# EasyEDA Pro project ProProject_AD9833.epro, board SMT
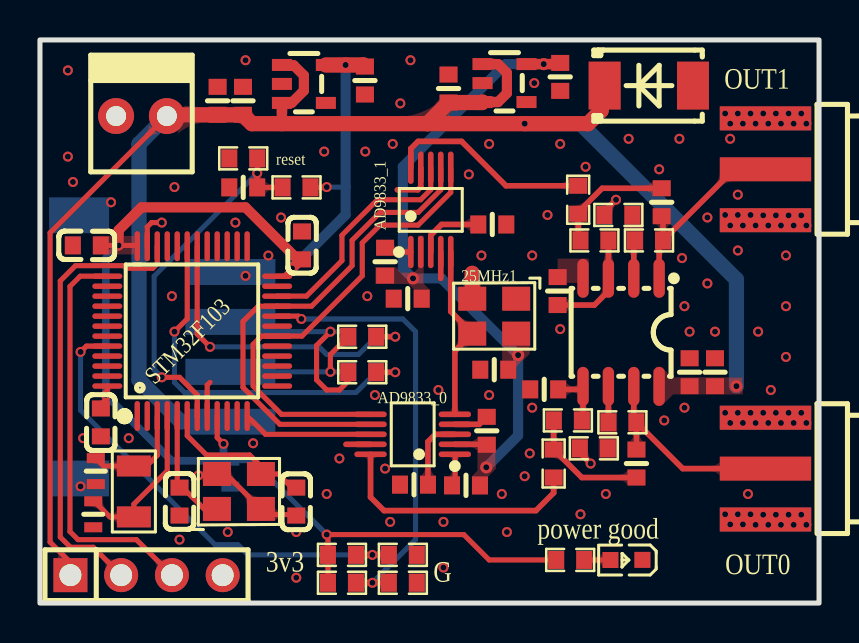
[diagram p10: board, top side]
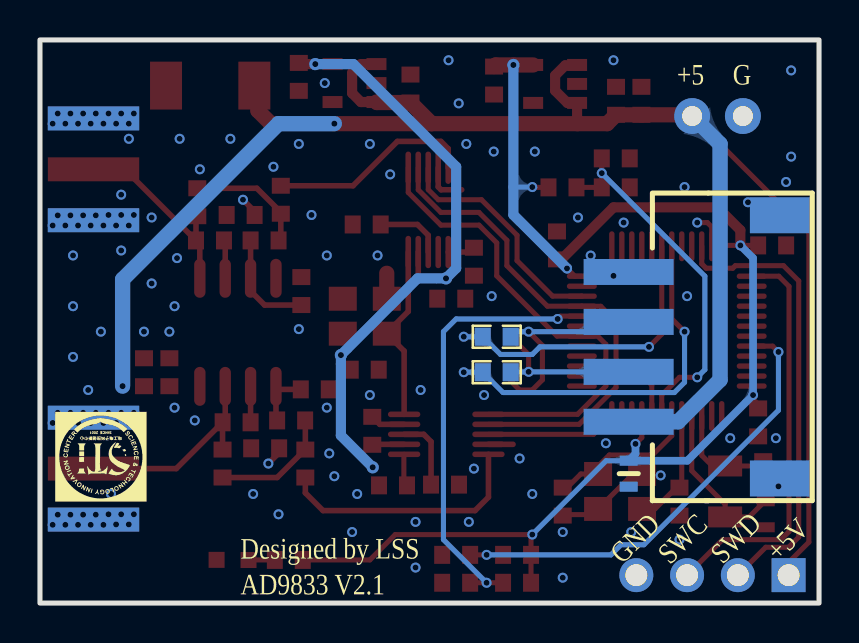
[diagram p11: board, bottom side, seen from below]

Outline 38.99 x 28.19 mm; copper layers: Top Layer, Bottom Layer. Coordinates in mm from the lower left corner of the outline.
Outline path: rectangle 0,28.19 38.99,0
Stack: Top Layer 0.035mm / Dielectric1 1.51mm FR4 er 4.5 / Bottom Layer 0.035mm

## Design rules (mm)
template: 自定义配置
spacing copperThickness1oz (default): track to track 0.102, other pairs 0.152 to 0.3
spacing copperThickness2oz: track to track 0.203, other pairs 0.152 to 0.3
track width copperThickness1oz (default): min 0.127, default 0.254, max 2.54
track width copperThickness2oz: min 0.203, default 0.254, max 2.54
differential pair differentialPair (default): width min 0.127, default 0.254, max 2.54; gap min 0.152, default 0.152
via viaSize (default): diameter min 0.5, default 0.61, max 10; hole min 0.3, default 0.305, max 6.299

## Placement (name value [footprint] x y rotation side)
25MHz1  25MHz  [OSC-SMD_4P-L3.2-W2.5-BL]  22.73 14.36 180 top
AD9833_0  AD9833WBRMZ-REEL  [MSOP-10_L3.0-W3.0-P0.50-LS5.0-BL]  18.65 8.45 90 top
AD9833_1  AD9833WBRMZ-REEL  [MSOP-10_L3.0-W3.0-P0.50-LS5.0-BL]  19.56 19.69 0 top
C1  10nF  [C0603]  21.32 5.89 180 top
C2  10nF  [C0603]  17.27 17.09 90 top
C3  10uF  [C0603]  8.89 25.15 270 top
C4  100nF  [C0603]  22.36 8.62 270 top
C5  100nF  [C0603]  18.41 15.24 0 top
C7  100nF  [C0603]  33.78 11.56 270 top
C8  100nF  [C0603]  22.74 11.68 0 top
C9  100nF  [C0603]  18.72 5.93 0 top
C10  100nF  [C0603]  22.64 18.95 180 top
C11  1uF  [C0603]  20.45 25.76 90 top
C12  1uF  [C0603]  26.03 26.34 90 top
C13  100nF  [C0603]  32.51 11.56 270 top
C14  1.5pF  [C0603]  25.91 15.62 270 top
C15  1.1pF  [C0603]  31.12 20.07 270 top
C16  1.5pF  [C0603]  25.24 10.7 0 top
C17  1.1pF  [C0603]  29.85 6.98 90 top
C18  20pF  [C0603]  6.99 5.08 270 top
C19  20pF  [C0603]  12.83 5.08 90 top
C20  20pF  [C0603 V1.2]  2.79 6.6 270 top
C21  20pF  [C0603 V1.2]  2.67 4.44 270 top
C29  0.1uF  [c0603]  10.17 20.81 0 top
C30  1uF  [C0603]  10.16 25.15 270 top
C31  1uF  [C0603]  16.26 26.16 90 top
C32  100nF  [C0603]  3.05 9.04 90 top
C33  100nF  [C0603]  2.35 17.91 0 top
C34  100nF  [C0603]  13.12 17.91 270 top
C35  100nF  [C0603 V1.2]  9.53 6.48 90 bottom
CN1  X8821WRS-04-9TSN  [conn-smd_x8821wrs-04-9tsn]  5.97 12.83 90 bottom
D4  SMBJ5.0A  [smb_l4.4-w3.6-ls5.3-rd]  30.48 25.91 0 top
H1  PZ254V-11-04P  [HDR-TH_4P-P2.54-V-M]  5.33 1.4 0 top
LED1  NCD0603R1  [LED0603-RD_RED]  29.35 2.16 180 top
Power1  -  [KF2510_2P]  5.08 24.38 0 top
R9  10k  [R0603]  28.95 19.43 0 top
R10  10k  [R0603]  30.48 18.16 0 top
R11  10k  [R0603]  27.75 18.16 180 top
R13  10k  [R0603]  26.94 20.19 90 top
R14  10k  [R0603]  27.72 7.75 0 top
R15  10k  [R0603]  29.15 9.05 0 top
R16  10k  [R0603]  26.42 9.14 180 top
R18  10k  [R0603]  25.71 6.98 270 top
R19  10k  [R0603]  12.84 20.81 0 top
R20  10k  [R0603]  16.13 13.33 180 top
R21  10k  [R0603]  16.13 11.56 180 top
R22  10k  [R0603]  16.13 11.56 0 bottom
R23  10k  [R0603]  16.13 13.33 180 bottom
R24  0  [R0603]  15.11 2.41 180 top
R25  0  [R0603]  18.16 2.41 180 top
R26  0  [R0603]  15.11 1.02 180 top
R27  0  [R0603]  18.16 1.02 180 top
R28  3k  [R0603]  26.54 2.16 180 top
reset  10k  [R0603]  10.17 22.26 0 top
RF1  BWSMA-KE-P001  [SMA-SMD_BWSMA-KE-P001]  36.19 6.73 0 top
RF2  BWSMA-KE-P001  [SMA-SMD_BWSMA-KE-P001]  36.19 21.72 0 top
U6  TPLP5907MFX-3.3  [SOT-23-5_L2.9-W1.6-P0.95-LS2.8-BR]  23.25 26.03 180 top
U7  OPA2350UA/2K5G4  [SOIC-8_L5.0-W4.0-P1.27-LS6.1-BL]  29.08 13.55 180 top
U8  STM32F103C8T6  [LQFP-48_L7.0-W7.0-P0.50-LS9.0-BL]  7.62 13.61 0 top
U9  TPS7A2033PDBVR  [SOT-23-5_L2.9-W1.6-P0.95-LS2.8-BR]  13.21 25.99 180 top
X1  8MHz  [OSC-SMD_4P-L3.2-W2.5-BL]  9.96 5.59 0 top
X2  32.768kHz  [OSC-SMD_L3.2-W1.5]  4.7 5.59 270 top

## Footprints (pads in the part's own frame, mm; a bottom-side part is the same pattern mirrored in y, then rotated)
c0603
  rect 0.8x0.9 smd: 1(-0.7,0) 2(0.7,0)
C0603
  rect 0.8x0.9 smd: 1(-0.7,0) 2(0.7,0)
C0603 V1.2
  rect 0.5x0.9 smd: 1(-0.65,0) 2(0.65,0)
conn-smd_x8821wrs-04-9tsn
  rect 1.3x4.5 smd: 1(-3.75,3.56) 2(-1.25,3.56) 3(1.25,3.56) 4(3.75,3.56)
  rect 1.8x3 smd: 5(6.59,-4.01) 6(-6.59,-4.01)
HDR-TH_4P-P2.54-V-M
  rect 1.7x1.7 hole 1.1: 1(-3.81,0)
  round 1.7 hole 1.1: 2(-1.27,0) 3(1.27,0) 4(3.81,0)
KF2510_2P
  rrect 1.8x1.8 hole 1: 1(-1.27,0) 2(1.27,0)
LED0603-RD_RED
  rect 0.8x0.8 smd: 1(-0.799,-0.004) 2(0.799,0.004)
LQFP-48_L7.0-W7.0-P0.50-LS9.0-BL
  oval 0.27x1.5 smd: 1(-2.75,-4.25) 2(-2.25,-4.25) 3(-1.75,-4.25) 4(-1.25,-4.25) 5(-0.75,-4.25) 6(-0.25,-4.25) 7(0.25,-4.25) 8(0.75,-4.25) 9(1.25,-4.25) 10(1.75,-4.25) 11(2.25,-4.25) 12(2.75,-4.25) 25(2.75,4.25) 26(2.25,4.25) 27(1.75,4.25) 28(1.25,4.25) 29(0.75,4.25) 30(0.25,4.25) 31(-0.25,4.25) 32(-0.75,4.25) 33(-1.25,4.25) 34(-1.75,4.25) 35(-2.25,4.25) 36(-2.75,4.25)
  oval 1.5x0.27 smd: 13(4.25,-2.75) 14(4.25,-2.25) 15(4.25,-1.75) 16(4.25,-1.25) 17(4.25,-0.75) 18(4.25,-0.25) 19(4.25,0.25) 20(4.25,0.75) 21(4.25,1.25) 22(4.25,1.75) 23(4.25,2.25) 24(4.25,2.75) 37(-4.25,2.75) 38(-4.25,2.25) 39(-4.25,1.75) 40(-4.25,1.25) 41(-4.25,0.75) 42(-4.25,0.25) 43(-4.25,-0.25) 44(-4.25,-0.75) 45(-4.25,-1.25) 46(-4.25,-1.75) 47(-4.25,-2.25) 48(-4.25,-2.75)
MSOP-10_L3.0-W3.0-P0.50-LS5.0-BL
  oval 0.28x1.62 smd: 1(-1,-2.11) 2(-0.5,-2.11) 3(0,-2.11) 4(0.5,-2.11) 5(1,-2.11) 6(1,2.11) 7(0.5,2.11) 8(0,2.11) 9(-0.5,2.11) 10(-1,2.11)
OSC-SMD_4P-L3.2-W2.5-BL
  rect 1.4x1.2 smd: 1(-1.1,-0.875) 2(1.1,-0.875) 3(1.1,0.875) 4(-1.1,0.875)
OSC-SMD_L3.2-W1.5
  rect 1.05x1.7 smd: 1(-1.275,0) 2(1.275,0)
R0603
  rect 0.8x0.9 smd: 1(-0.7,0) 2(0.7,0)
SMA-SMD_BWSMA-KE-P001
  rect 4.572x1.2 smd: 1(0.115,-2.55) 2(0.115,2.55) 5(0.115,0)
  rect 4.572x1.2 smd far side: 3(0.115,2.55) 4(0.115,-2.55)
smb_l4.4-w3.6-ls5.3-rd
  rect 1.6x2.4 smd: 1(-2.22,0) 2(2.2,0)
SOIC-8_L5.0-W4.0-P1.27-LS6.1-BL
  oval 0.569x1.95 smd: 1(-1.905,-2.705) 2(-0.635,-2.705) 3(0.635,-2.705) 4(1.905,-2.705) 5(1.905,2.705) 6(0.635,2.705) 7(-0.635,2.705) 8(-1.905,2.705)
SOT-23-5_L2.9-W1.6-P0.95-LS2.8-BR
  rect 1x0.6 smd: 1(1.1,-0.95) 2(1.1,0) 3(1.1,0.95) 4(-1.1,0.95) 5(-1.1,-0.95)

## Nets
As in the schematic, except:
3V3: C31.2 C32.2 C33.2 C34.2 C35.2 R19.2 R24.2 R26.2 R28.2 U8.9 U8.24 U8.36 U8.48 U9.5

Pads without a net: 25MHz1 1; U6 4; U8 1; U9 4

## Via types
v1: diameter 0.61, hole 0.305, Top Layer to Bottom Layer, 7 vias
v2: diameter 0.5, hole 0.299, Top Layer to Bottom Layer, 105 vias
v3: diameter 0.5, hole 0.3, Top Layer to Bottom Layer, 43 vias

## Routing (per net, layer and track width the routed paths; a pad name or vN(x,y) marks a point on that pad's centre or on a via; arc(x,y) is an arc through that point)
3V3: length 69.7
  Top Layer w0.254: R26.2 R24.2 14.41,3.37 v3(14.35,3.43) 21.21,3.43 22.48,2.16 R28.2 ; v3(9.19,7.97) 8.87,8.29 U8.9 ; v3(14.35,20.83) 14.34,20.81 R19.2 ; v3(12.61,16.76) 12.22,16.36 U8.24 ; 3.05,9.95 3.37,10.27 U8.48 ; U8.36 4.83,17.91 v3(3.94,17.91) 3,17.91
  Top Layer w0.508: v3(3.94,17.91) 3.94,18.67 5.08,19.81 10.29,19.81 12.84,17.26 13.12,17.26 v3(12.61,16.76)
  Top Layer w0.762: U9.5 v1(15.3,26.94) 16.18,26.94 C31.2
  Bottom Layer w0.254: 9.53,7.13 10.65,7.13 v3(14.35,3.43) ; v3(14.35,20.83) 15.29,20.83 15.3,20.82
  Bottom Layer w0.381: v3(9.19,7.97) 9.19,7.47 9.53,7.13 6.59,7.13 v3(3.3,10.41) 3.3,17.27 v3(3.94,17.91)
  Bottom Layer w0.508: v3(12.61,16.76) 15.3,19.44 v1(15.3,26.94)
+5V: length 99.2
  Top Layer w0.254: H1.1 1.52,2.03 0.51,3.05 0.51,18.54 6.35,24.38
  Top Layer w0.508: 12.09,24 12.11,24.02 U9.3 12.6,25.04 13.21,25.65 13.21,26.42 12.7,26.92 12.13,26.92 U9.1 ; U6.3 22.93,25.08 23.37,25.53 23.37,26.54 22.93,26.98 U6.1
  Top Layer w0.762: 28.08,25.91 28.08,24.65 27.43,24 v1(24.26,24) 19.39,24 ; 19.39,24 C11.1 22.12,25.06 U6.3 ; 19.39,24 10.6,24 C30.2 C3.2 6.41,24.45 6.35,24.38
  Bottom Layer w0.762: 6.35,24.38 4.95,22.99 4.95,11.18 7.05,9.08 CN1.1 ; v1(24.26,24) 27.05,24 34.85,16.2 v1(34.85,10.86)
GND: length 19.1
  Top Layer w0.254: v3(6.1,19.05) 5.59,19.05 5.37,18.83 U8.35 ; v2(7.93,6.39) 8.79,6.39 X1.4 9.31,6.46 X1.2 11.34,4.43 12.83,4.43 ; 8.51,11.05 8.37,10.91 U8.8
  Top Layer w0.28: v2(27.56,6.98) 27.02,7.52 R14.1 ; 17.88,20.69 18.91,20.69 19.06,20.84 AD9833_1.9 ; AD9833_1.4 20.06,16.26 ; C4.1 21.98,8.95 AD9833_0.4 ; R9.1 28.25,19.61 v2(28.83,20.19) ; 16.54,7.95 15.31,7.95
  Top Layer w0.762: 25MHz1.2 21.63,16.51
  vias: v2(1.65,21.08) v2(2.03,5.84) v2(3.56,20.07) v2(12.83,1.27) v2(14.99,7.24) v2(17.27,6.73) v2(17.53,4.06) v2(19.94,10.67) v2(20.19,4.06) v2(20.19,1.78) v2(22.09,17.4) v2(22.48,10.41) v2(23.11,5.46) v2(23.37,3.56) v2(24.26,6.35) v2(24.51,7.49) v2(24.63,17.4) v2(24.63,9.78) v2(25.4,19.43) v2(26.03,22.99) v2(26.03,13.72) v2(27.05,4.44) v2(27.31,21.84) v2(28.32,5.46) v2(29.46,23.24) v2(30.99,21.72) v2(31.24,9.14) v2(32,23.24) v2(32.13,17.27) v2(32.25,14.86) v2(32.25,9.78) v2(32.51,13.59) v2(33.4,19.3) v2(33.4,16) v2(33.78,13.59) v2(34.29,24.51) v2(34.29,19.43) v2(34.29,9.52) v2(34.29,4.44) v2(34.54,24) v2(34.54,23.24) v2(34.54,18.9) v2(34.54,9.02) v2(34.54,3.94) v2(34.93,24.51) v2(34.93,20.45) v2(34.93,19.43) v2(34.93,17.65) v2(34.93,9.52) v2(34.93,4.44) v2(35.18,24) v2(35.18,18.9) v2(35.18,9.02) v2(35.18,3.94) v2(35.43,5.46) v2(35.56,24.51) v2(35.56,19.43) v2(35.56,9.52) v2(35.56,4.44) v2(35.81,24) v2(35.81,18.9) v2(35.81,9.02) v2(35.81,3.92) v2(35.94,13.59) v2(36.19,24.51) v2(36.19,19.41) v2(36.19,9.52) v2(36.19,4.42) v2(36.45,24) v2(36.45,18.9) v2(36.45,9.02) v2(36.45,3.92) v2(36.58,10.67) v2(36.83,24.51) v2(36.83,19.41) v2(36.83,9.52) v2(36.83,4.42) v2(37.08,24) v2(37.08,18.9) v2(37.08,9.02) v2(37.08,3.92) v2(37.33,17.4) v2(37.33,14.86) v2(37.33,12.32) v2(37.47,24.51) v2(37.47,19.41) v2(37.47,9.52) v2(37.47,4.42) v2(37.72,24) v2(37.72,18.9) v2(37.72,9.02) v2(37.72,3.92) v2(38.1,24.51) v2(38.1,19.41) v2(38.1,9.52) v2(38.1,4.42) v2(38.35,24) v2(38.35,18.9) v2(38.35,9.02) v2(38.35,3.92) v3(1.4,26.67) v3(1.4,22.35) v3(2.16,8.25) v3(4.44,8.25) v3(6.6,15.37) v3(6.73,20.83) v3(6.99,3.17) v3(9.4,3.56) v3(9.78,19.05) v3(10.29,27.18) v3(10.29,16.38) v3(10.67,8) v3(11.43,17.4) v3(12.06,19.3) v3(12.83,3.56) v3(14.22,22.61) v3(14.35,5.46) v3(16.28,22.61) v3(16.38,15.37) v3(16.76,10.41) v3(17.65,22.99) v3(18.03,25.02) v3(18.54,27.18) v3(21.46,21.46) v3(22.48,22.99) v3(24.74,26.03)
VCC: length 31.4
  Top Layer w0.28: AD9833_0.2 22.29,7.95 22.34,7.89
  Top Layer w0.508: 24.35,26.98 v1(25.21,26.98) 25.98,26.98 C12.2
  Bottom Layer w0.508: v1(25.21,26.98) 23.3,26.98 18.16,21.84 18.16,16.76 v1(18.67,16.26) 20.09,16.26 v1(23.93,12.42) 23.93,8.39 v1(22.34,6.8)
8M_IN: length 6
  Top Layer w0.254: X1.1 8.21,4.71 7.06,5.86 ; 7.06,5.86 C18.1 ; 7.06,5.86 6.87,6.05 U8.5
8M_OUT: length 7.8
  Top Layer w0.254: U8.6 7.37,8.38 8.33,7.41 10.49,7.41 11.06,6.85 X1.3 11.92,6.46 12.65,5.73 12.83,5.73
32K_IN: length 5.4
  Top Layer w0.254: C20.1 3.19,6.86 X2.1 4.7,6.86 5.33,6.86 5.87,7.39 U8.3
32K_OUT: length 8.1
  Top Layer w0.254: U8.4 6.37,6.62 4.7,4.95 4.7,4.31 3.5,4.31 2.67,5.14
A2: length 6.6
  Top Layer w0.254: 16.54,8.45 11.29,8.45 U8.12
A9: length 16
  Top Layer w0.254: v3(17.78,13.33) R20.1 ; U8.30 7.87,13.47 v3(8.51,12.83)
  Bottom Layer w0.254: v3(8.51,12.83) 13.97,12.83 14.35,12.45 15.94,12.45 R20.1 v3(17.78,13.33)
A10: length 19.7
  Top Layer w0.254: v3(17.78,11.56) R21.1 ; U8.31 7.37,14.23 v2(6.73,13.59)
  Bottom Layer w0.254: v3(17.78,11.56) R21.1 15.81,10.54 7.24,10.54 6.73,11.05 v2(6.73,13.59)
A13: length 22.9
  Top Layer w0.254: U8.34 5.87,16.99 5.65,16.76 4.32,16.76 4.19,16.89 1.78,16.89 1.02,16.13 1.02,3.3 1.52,2.79 2.67,2.79 H1.2
A14: length 20.4
  Top Layer w0.254: U8.37 2.01,16.36 1.5,15.85 1.5,3.58 1.91,3.17 4.83,3.17 H1.3
B0: length 23.8
  Top Layer w0.254: AD9833_1.6 20.56,20.56 18.92,18.92 17.02,18.92 16.13,18.03 16.13,16.38 13.11,13.36 U8.18 11.08,13.36 10.67,12.95 10.67,10.86 12.09,9.45 16.54,9.45
B10: length 24.9
  Top Layer w0.254: 16.54,8.95 12.01,8.95 10.16,10.8 10.16,14.1 10.92,14.86 11.87,14.86 U8.21 13.59,14.86 15.62,16.89 15.62,18.16 17.02,19.56 18.92,19.56 20.06,20.69 AD9833_1.7
B11: length 11.7
  Top Layer w0.254: U8.22 11.87,15.37 13.34,15.37 15.11,17.14 15.11,18.41 16.89,20.19 19.05,20.19 19.56,20.7 AD9833_1.8
BOOT0: length 23.6
  Top Layer w0.254: v3(2.03,12.57) 2.32,12.86 U8.44 ; R24.1 v3(16.64,2.41) R25.2
  Bottom Layer w0.254: v3(16.64,2.41) 10.41,2.41 9.91,2.92 8.76,2.92 2.03,9.65 v3(2.03,12.57)
BOOT1: length 22.4
  Top Layer w0.254: R26.1 v3(16.64,1.02) R27.2 ; U8.20 12.94,14.36 v2(13.08,14.22)
  Bottom Layer w0.254: v2(13.08,14.22) 18.16,14.22 18.8,13.59 18.8,3.17 v3(16.64,1.02)
CAP0: length 3.7
  Top Layer w0.28: 19.42,5.85 19.42,8.08 19.78,8.45 AD9833_0.3
CAP1: length 3.6
  Top Layer w0.28: 22.09,18.95 20.1,18.95 19.56,18.41 AD9833_1.3
COMP0: length 1.6
  Top Layer w0.254: AD9833_0.1 20.78,7.44 20.78,5.89
COMP1: length 1.4
  Top Layer w0.28: C2.2 17.49,17.58 AD9833_1.1
MCLK: length 8.9
  Top Layer w0.28: AD9833_0.5 20.76,12.62 25MHz1.3 21.63,13.52 20.56,14.6 AD9833_1.5
RESET: length 18.4
  Top Layer w0.254: reset.2 v3(10.87,21.52) C29.2 R19.1 ; 7.87,9.36 7.87,9.37 ; 7.87,9.37 7.87,10.41 6.99,11.3 v3(6.1,11.3) ; 7.87,9.37 U8.7
  Bottom Layer w0.254: v3(10.87,21.52) 5.72,16.37 5.72,11.68 v3(6.1,11.3)
RX: length 11.3
  Top Layer w0.254: R21.2 15.43,11.11 14.99,10.67 14.35,10.67 13.84,11.18 13.84,12.9 v3(14.53,13.59)
  Bottom Layer w0.254: CN1.3 10.02,13.59 v3(14.53,13.59) 15.18,13.59 R23.2
SIG0: length 11.4
  Top Layer w0.28: U7.7 29.72,9.18 29.85,9.05 ; 37.07,6.73 32.17,6.73 29.85,9.05 ; C17.2 29.85,9.05
SIG1: length 10.6
  Top Layer w0.28: U7.1 30.99,17.96 31.18,18.16 ; 31.18,18.16 34.74,21.72 37.07,21.72 ; 31.18,18.16 31.18,19.3 C15.2
TX: length 8
  Top Layer w0.254: v3(14.53,11.58) 14.53,12.44 R20.2
  Bottom Layer w0.254: CN1.2 v3(14.53,11.58) 15.41,11.58 R22.1
VOUT0: length 12.7
  Top Layer w0.28: 16.54,7.45 16.54,5.3 17.22,4.63 24.82,4.63 25.71,5.52 R18.2
VOUT1: length 10.4
  Top Layer w0.28: AD9833_1.10 18.56,22.75 18.92,23.11 21.1,23.11 23.32,20.89 R13.2
$1N1456: length 1.9
  Top Layer w0.28: R10.1 29.72,18.09 U7.2
$1N1462: length 1.8
  Top Layer w0.28: U7.6 R15.1
$1N1470: length 5.5
  Top Layer w0.28: C14.2 27.75,14.92 28.57,15.75 28.57,16.38 ; 28.45,18.16 U7.3
$1N1471: length 6.1
  Top Layer w0.28: R11.2 26.94,18.27 R13.1 26.94,19.57 28.13,20.77 C15.1
$1N1472: length 3
  Top Layer w0.28: C16.2 27.03,10.7 U7.5 27.18,9.2 R16.1
$1N1475: length 6.2
  Top Layer w0.28: C17.1 27.12,6.28 25.72,7.69 R18.1 25.71,9.13 R16.2
$1N10877: length 1.3
  Top Layer w0.254: LED1.2 28.55,2.16 R28.1

## Copper pours and planes (outline as drawn; the poured copper is in the pictures)
3V3 on Top Layer: 2.75,18.38 4.95,18.38 4.95,17.45 2.75,17.45
+5V on Top Layer: 30.69,11.83 35.18,11.83 35.18,9.87 30.69,9.87
GND on Top Layer: 0,28.19 38.99,28.19 38.99,0 0,0
GND on Top Layer: 25.91,17.24 27.47,17.24 27.47,16.03 25.91,16.03
GND on Bottom Layer: 0,28.19 38.99,28.19 38.99,0 0,0
VCC on Top Layer: 23.11,14.1 24.51,14.1 24.51,11.28 23.11,11.28
VCC on Top Layer: 21.61,8.32 22.82,8.32 22.82,5.44 21.61,5.44
VCC on Top Layer: 16.78,18.39 19.51,18.39 19.51,14.79 16.78,14.79
$1N1456 on Top Layer: 29.26,19.9 30.2,19.9 30.2,17.69 29.26,17.69
$1N1462 on Top Layer: 27.96,9.52 28.89,9.52 28.89,7.28 27.96,7.28

Small or netless copper shapes (teardrops, artwork), in the pictures only: 158 on Top Layer, 32 on Bottom Layer

## Text on the board
Bottom Silkscreen Layer: +5V | SWD | SWC | GND | G | +5 | Designed by LSS / AD9833 V2.1
Top Silkscreen Layer: STM32F103 | 3v3 | G | power good | OUT1 | OUT0
